# EAGLE design hmc5843 (EAGLE 5.10)
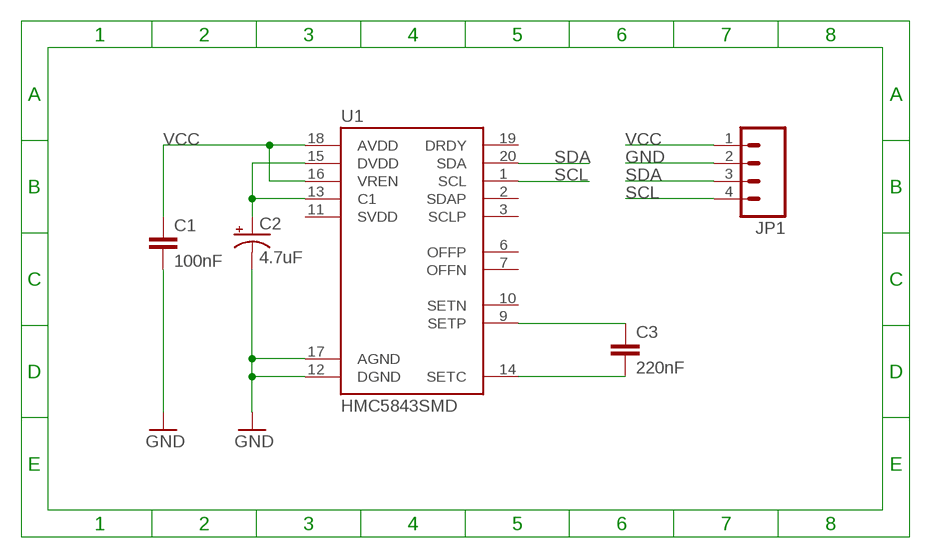
[diagram p0: schematic, sheet 1]

## Parts
C1  100nF  C-EUC0805  [C0805]
C2  4.7uF  CPOL-USSMCA  [SMC_A]
C3  220nF  C-EUC0805  [C0805]
JP1  M04PTH  [1X04]
U1  HMC5843SMD  [LPCC20]

## Nets
GND: C1.2 C2.- JP1.2 U1.12(DGND) U1.17(AGND)
N$2: C2.+ U1.13(C1) U1.15(DVDD)
N$3: C3.1 U1.9(SETP)
N$4: C3.2 U1.14(SETC)
SCL: JP1.4 U1.1(SCL)
SDA: JP1.3 U1.20(SDA)
VCC: C1.1 JP1.1 U1.16(VREN) U1.18(AVDD)
Unconnected: U1.2(SDAP) U1.3(SCLP) U1.6(OFFP) U1.7(OFFN) U1.10(SETN) U1.11(SVDD) U1.19(DRDY)

## Library data of the parts
C1 C3 = rcl:C-EU: CAPACITOR, European symbol
C2 = rcl:CPOL-US: POLARIZED CAPACITOR, American symbol
JP1 = SparkFun:M04: Header 4 Standard 4-pin 0.1" header. Use with straight break away headers (SKU : PRT-00116), right angle break away headers (PRT-00553), swiss pins (PRT-00743), machine pins (PRT-00117), and female headers (PRT-00115). Molex polarized connector foot print use with SKU : PRT-08231 with associated crimp pins and housings.
U1 = SparkFun:HMC5843

## Board
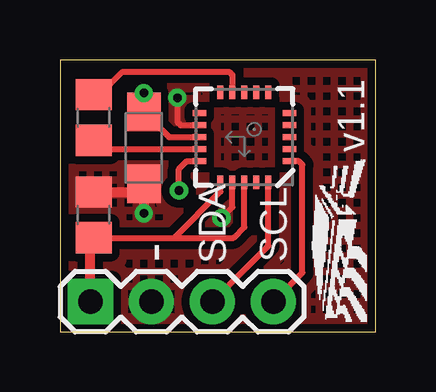
[diagram p1: board, top side]
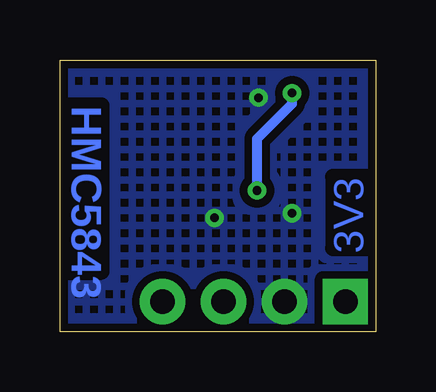
[diagram p2: board, bottom side, seen from below]

Size 13.16 x 11.35 mm. Coordinates in mm from the lower left corner, seen from the top.
Outline: 0,0 13.16,0 13.16,11.35 0,11.35 0,0
Copper layers (1*16): Top 0.035mm / dielectric 1.5mm / Bottom 0.035mm
Design rules "default *": minimum track width 10mil, minimum drill 24mil, track to track 8mil, track to pad 8mil, pad to pad 8mil, via to via 8mil, smd to smd 8mil, copper to edge 5mil, drill to drill 8mil, minimum pad ring 10mil, minimum via ring 8mil, stop-mask expansion 4mil, vias tented up to drill 0mil, thermal gap 10mil

### Footprints (pad centres in the part's own frame; a part is rotated, then mirrored left to right if it is on the bottom)
C0805 = smd 1.3 x 1.5: 1 -0.95,0; 2 0.95,0
SMC_A = smd 1.6 x 1.4: + -1.5,0; - 1.5,0
1X04 = drill 1.016 pad 1.88 square: 1 0,0 | drill 1.016 pad 1.88 round: 2 2.54,0; 3 5.08,0; 4 7.62,0
LPCC20 = smd 0.25 x 0.56: 1 1,1.88; 2 0.5,1.88; 3 0,1.88; 4 -0.5,1.88; 5 -1,1.88; 11 -1,-1.88; 12 -0.5,-1.88; 13 0,-1.88; 14 0.5,-1.88; 15 1,-1.88 | smd 0.56 x 0.25: 6 -1.88,1; 7 -1.88,0.5; 8 -1.88,0; 9 -1.88,-0.5; 10 -1.88,-1; 16 1.88,-1; 17 1.88,-0.5; 18 1.88,0; 19 1.88,0.5; 20 1.88,1

### Placement (x,y rotation side)
C1  1.4,4.89 90 top
C2  3.49,7.68 270 top
C3  1.4,8.95 270 top
JP1  1.27,1.27 0 top
U1  7.68,8.13 270 top

### Tracks (layer width: path | path; a pad name or v marks a point on that pad's centre or on a via)
GND  (via drill 0.36)
  Top 0.254: U1.12 5.02,8.63 4.89,8.76 v4.89,9.78 | U1.17 7.18,5.21 v6.73,4.76
  Top 0.406: C1.2 3.15,5.84 C2.- v3.49,4.95
  pour Bottom (isolate 0.33, no thermals, hatched): 0,11.37 0,-0.06 13.54,-0.06 13.54,11.24 5.78,11.24
  pour Top (isolate 0.33, no thermals, hatched): 0,11.37 0,-0.06 13.44,-0.11 13.44,11.19 5.78,11.24
N$2  (via drill 0.36)
  Top 0.254: U1.13 4.55,8.13 C2.+ | U1.15 5.29,7.13 4.95,6.79 v4.95,5.91
  Top 0.406: v3.49,9.97 C2.+
  Bottom 0.406: v3.49,9.97 3.49,9.53 4.95,8.06 v4.95,5.91
N$3
  Top 0.254: C3.1 1.65,9.9 2.6,10.86 7.05,10.86 7.18,10.72 U1.9
N$4
  Top 0.254: U1.14 1.77,7.63 C3.2
SCL
  Top 0.254: U1.1 9.95,7.13 10.1,6.99 10.1,2.48 JP1.4
SDA
  Top 0.254: U1.20 8.68,3.6 JP1.3
VCC
  Top 0.254: U1.16 6.68,5.86 4.76,3.94 | 4.76,3.94 C1.1 | U1.18 7.68,4.38 7.24,3.94 4.76,3.94
  Top 0.406: JP1.1 1.27,3.81 C1.1

### Text on the board
Bottom: HMC5843 | 3V3
tNames: v1.1 | - | SDA | SCL